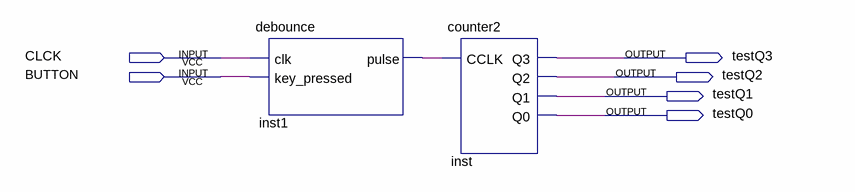
[diagram p0: schematic sheet]
// Quartus schematic test1_debouncer.bdf as structural Verilog: 2 symbols, 6 pins
module test1_debouncer (
  input  CLCK,
  input  BUTTON,
  output testQ3,
  output testQ2,
  output testQ1,
  output testQ0
);

  wire inst1_pulse;

  debounce inst1 (.clk(CLCK), .key_pressed(BUTTON), .pulse(inst1_pulse));
  counter2 inst (.CCLK(inst1_pulse), .Q3(testQ3), .Q2(testQ2), .Q1(testQ1), .Q0(testQ0));
endmodule
